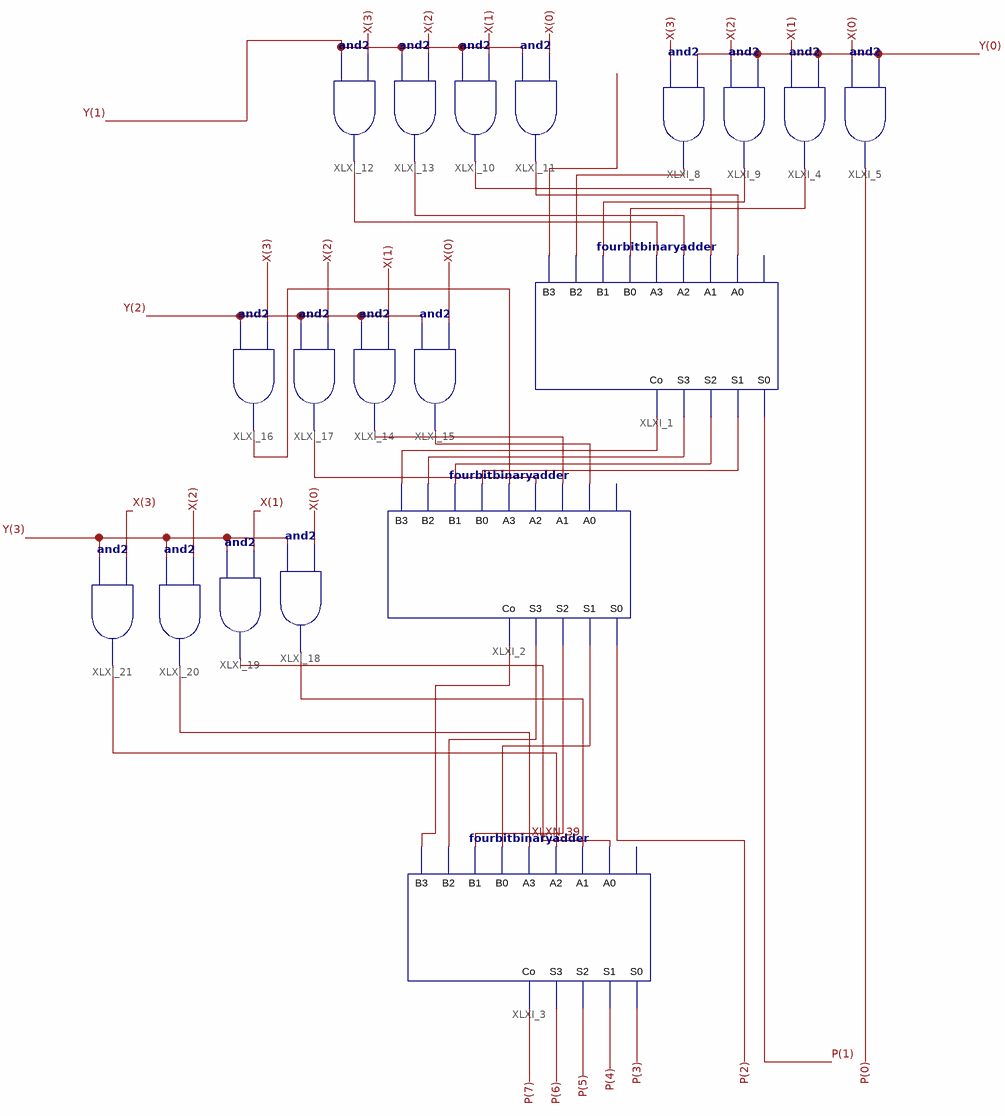
[diagram p0: schematic sheet 1]
// Xilinx ISE schematic fourbitmultiplier.sch (artix7) as structural Verilog: 19 symbols, 0 ports
module fourbitmultiplier (
);

  wire XLXN_2, XLXN_3, XLXN_4, XLXN_5, XLXN_6, XLXN_7, XLXN_8, XLXN_9, XLXN_11, XLXN_12, XLXN_13, XLXN_14,
       XLXN_15, XLXN_16, XLXN_17, XLXN_18, XLXN_20, XLXN_21, XLXN_23, XLXN_38, XLXN_39, XLXN_41, XLXN_42,
       XLXN_43;
  wire [3:0] X, Y;
  wire [7:0] P;

  fourbitbinaryadder XLXI_1 (
    .A0(XLXN_5), .B0(XLXN_2), .A1(XLXN_6), .B1(XLXN_3), .B2(XLXN_4), .A2(XLXN_7), .A3(XLXN_8), .B3(XLXN_9),
    .Co(XLXN_11), .S2(XLXN_13), .S1(XLXN_14), .S3(XLXN_12), .S0(P[1]));  // open: Cin
  fourbitbinaryadder XLXI_2 (
    .A0(XLXN_15), .B0(XLXN_14), .A1(XLXN_16), .B1(XLXN_13), .B2(XLXN_12), .A2(XLXN_17), .A3(XLXN_18),
    .B3(XLXN_11), .Co(XLXN_23), .S2(XLXN_21), .S1(XLXN_20), .S3(XLXN_42), .S0(P[2]));  // open: Cin
  and XLXI_4 (XLXN_2, X[1], Y[0]);
  and XLXI_5 (P[0], X[0], Y[0]);
  and XLXI_8 (XLXN_4, X[3], Y[0]);
  and XLXI_9 (XLXN_3, X[2], Y[0]);
  and XLXI_10 (XLXN_6, Y[1], X[1]);
  and XLXI_11 (XLXN_5, Y[1], X[0]);
  and XLXI_12 (XLXN_8, Y[1], X[3]);
  and XLXI_13 (XLXN_7, Y[1], X[2]);
  and XLXI_14 (XLXN_16, Y[2], X[1]);
  and XLXI_15 (XLXN_15, Y[2], X[0]);
  and XLXI_16 (XLXN_18, Y[2], X[3]);
  and XLXI_17 (XLXN_17, Y[2], X[2]);
  fourbitbinaryadder XLXI_3 (
    .A0(XLXN_39), .B0(XLXN_20), .A1(XLXN_38), .B1(XLXN_21), .B2(XLXN_42), .A2(XLXN_41), .A3(XLXN_43),
    .B3(XLXN_23), .Co(P[7]), .S2(P[5]), .S1(P[4]), .S3(P[6]), .S0(P[3]));  // open: Cin
  and XLXI_18 (XLXN_38, Y[3], X[0]);
  and XLXI_19 (XLXN_39, Y[3], X[1]);
  and XLXI_20 (XLXN_43, Y[3], X[2]);
  and XLXI_21 (XLXN_41, Y[3], X[3]);
endmodule
